# Altium schematic sheet MarsCarrier.SchDoc: My title
size A3; Organization: University of California; Address1: 475 Portola Plaza; Address2: Los Angeles, CA 90095; Revision: R01; SheetNumber: 1; SheetTotal: 1
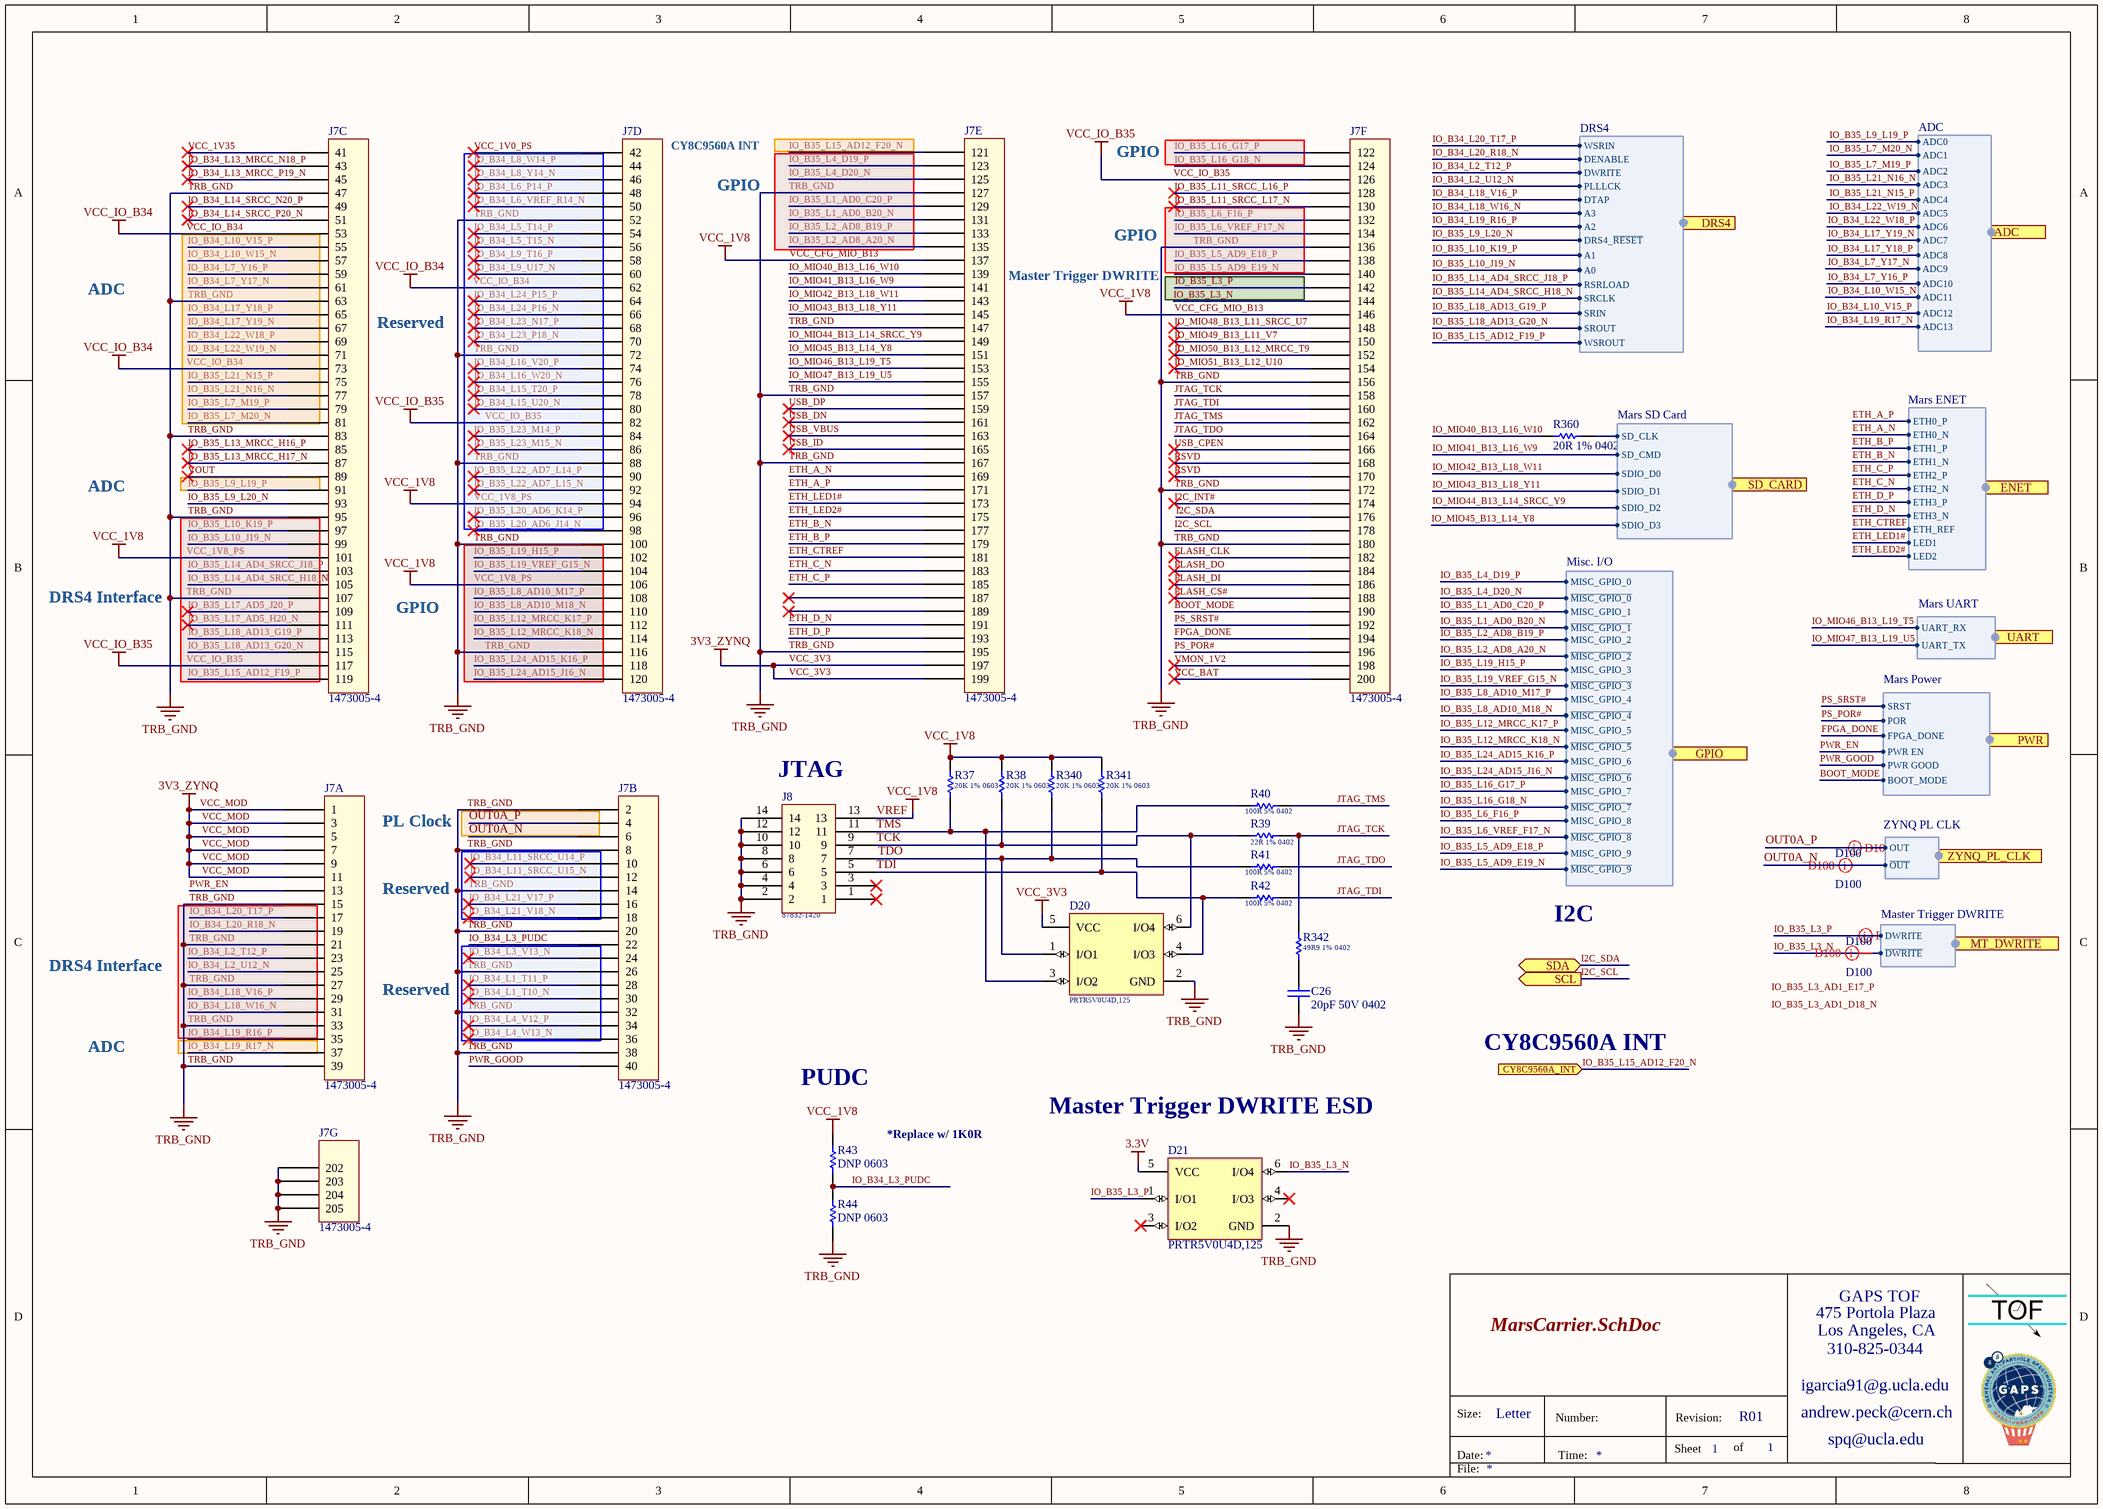
[diagram p0: MarsCarrier.SchDoc]

## Parts
C26  Capacitance: 20pF 50V 0402  [Cap_Murata_GJM1555C1H200GB01D_20pF]  (hidden comment: Cap_Murata_GJM1555C1H200GB01D_20pF)
D20  PRTR5V0U4D,125  [PRTR5V0U4D,125]
D21  PRTR5V0U4D,125  [PRTR5V0U4D,125]
J7  Series: 1473005-4  [DIMM_TE_Connectivity_1473005-4_200POS]  (hidden comment: DIMM_TE_Connectivity_1473005-4_200POS)  (parts A,B,C,D,E,F,G of 7)
J8  Series: 87832-1420  [Header_Molex_87832-1420_14POS]  (hidden comment: Header_Molex_87832-1420_14POS)
R37  20K 1% 0603  [RESC0603(1608)_L]
R38  20K 1% 0603  [RESC0603(1608)_L]
R39  22R 1% 0402  [RESC0402(1005)_L]
R40  100R 5% 0402  [RESC0402(1005)_L]
R41  100R 5% 0402  [RESC0402(1005)_L]
R42  100R 5% 0402  [RESC0402(1005)_L]
R43  Resistance: DNP 0603  [RES_DNP_0603]  (hidden comment: RES_DNP_0603)
R44  Resistance: DNP 0603  [RES_DNP_0603]  (hidden comment: RES_DNP_0603)
R340  20K 1% 0603  [RESC0603(1608)_L]
R341  20K 1% 0603  [RESC0603(1608)_L]
R342  49R9 1% 0402  [RESC0402(1005)_L]
R360  Resistance: 20R 1% 0402  [Res_ROHM_SFR01MZPF20R0_20_Ohm]  (hidden comment: Res_ROHM_SFR01MZPF20R0_20_Ohm)

## Ports
ADC (harness ADC), CY8C9560A_INT (in), DRS4 (harness DRS4), ENET (harness Mars ENET), GPIO (harness Misc. I/O), MT_DWRITE (harness Master Trigger DWRITE), PWR (harness Mars Power), SCL (out), SD_CARD (harness Mars SD Card), SDA (bidir), UART (harness Mars UART), ZYNQ_PL_CLK (harness ZYNQ PL CLK)

## Harnesses
Mars SD Card: SDIO_D2, SDIO_D1, SDIO_D0, SD_CMD, SD_CLK, SDIO_D3
Mars UART: UART_RX, UART_TX
ADC: ADC0, ADC1, ADC2, ADC3, ADC4, ADC5, ADC6, ADC7, ADC8, ADC9, ADC10, ADC11, ADC12, ADC13
Mars ENET: ETH0_P, ETH0_N, ETH1_P, ETH1_N, ETH2_P, ETH2_N, ETH3_P, ETH3_N, ETH_REF, LED1, LED2
Mars Power: PWR GOOD, PWR EN, FPGA_DONE, SRST, POR, BOOT_MODE
ZYNQ PL CLK: OUT, ~{OUT}
Misc. I/O: MISC_GPIO_0, ~{MISC_GPIO_0}, MISC_GPIO_1, ~{MISC_GPIO_1}, MISC_GPIO_2, ~{MISC_GPIO_2}, MISC_GPIO_3, ~{MISC_GPIO_3}, MISC_GPIO_4, ~{MISC_GPIO_4}, MISC_GPIO_5, ~{MISC_GPIO_5}, MISC_GPIO_6, ~{MISC_GPIO_6}, MISC_GPIO_7, ~{MISC_GPIO_7}, MISC_GPIO_8, ~{MISC_GPIO_8}, MISC_GPIO_9, ~{MISC_GPIO_9}
Master Trigger DWRITE: DWRITE, ~{DWRITE}
DRS4: A3, A2, A1, A0, DTAP, SROUT, SRCLK, SRIN, RSRLOAD, WSROUT, DWRITE, PLLLCK, WSRIN, DENABLE, DRS4_~{RESET}

## Nets
3.3V: D21.5(VCC)
TRB_GND: C26.1 D20.2(GND) D21.2(GND) J7.2 J7.8 J7.14 J7.15 J7.20 J7.21 J7.26 J7.27 J7.32 J7.33 J7.38 J7.39 J7.47 J7.52 J7.63 J7.72 J7.83 J7.88 J7.95 J7.100 J7.107 J7.116 J7.127 J7.136 J7.147 J7.156 J7.157 J7.167 J7.172 J7.180 J7.195 J7.202 J7.203 J7.204 J7.205 J8.2 J8.4 J8.6 J8.8 J8.10 J8.12 J8.14 R44.2
VCC_1V8_PS: J7.94 J7.101 J7.106 J7.137 J7.146 J8.13 R37.2 R38.2 R43.1 R340.2 R341.2  [also labelled VCC_1V8, VCC_CFG_MIO_B13, VREF]
VCC_3V3: D20.5(VCC) J7.1 J7.3 J7.5 J7.7 J7.9 J7.11 J7.197 J7.199  [also labelled 3V3_ZYNQ, VCC_MOD]
VCC_IO_B34: J7.53 J7.62 J7.73
VCC_IO_B35: J7.82 J7.117 J7.126
BOOT_MODE: J7.190 ; port PWR.BOOT_MODE
ETH_A_N: J7.169 ; port ENET.ETH0_N
ETH_A_P: J7.171 ; port ENET.ETH0_P
ETH_B_N: J7.177 ; port ENET.ETH1_N
ETH_B_P: J7.179 ; port ENET.ETH1_P
ETH_C_N: J7.183 ; port ENET.ETH2_N
ETH_C_P: J7.185 ; port ENET.ETH2_P
ETH_CTREF: J7.181 ; port ENET.ETH_REF
ETH_D_N: J7.191 ; port ENET.ETH3_N
ETH_D_P: J7.193 ; port ENET.ETH3_P
ETH_LED1#: J7.173 ; port ENET.LED1
ETH_LED2#: J7.175 ; port ENET.LED2
FLASH_CLK: J7.182
FLASH_CS#: J7.188
FLASH_DI: J7.186
FLASH_DO: J7.184
FPGA_DONE: J7.194 ; port PWR.FPGA_DONE
I2C_INT#: J7.174
I2C_SCL: J7.178 ; port SCL
I2C_SDA: J7.176 ; port SDA
IO_B34_L1_T10_N: J7.30
IO_B34_L1_T11_P: J7.28
IO_B34_L2_T12_P: J7.23 ; port DRS4.DWRITE
IO_B34_L2_U12_N: J7.25 ; port DRS4.PLLLCK
IO_B34_L3_PUDC: J7.22 R43.2 R44.1
IO_B34_L3_V13_N: J7.24
IO_B34_L4_V12_P: J7.34
IO_B34_L4_W13_N: J7.36
IO_B34_L5_T14_P: J7.54
IO_B34_L5_T15_N: J7.56
IO_B34_L6_P14_P: J7.48
IO_B34_L6_VREF_R14_N: J7.50
IO_B34_L7_Y16_P: J7.59 ; port ADC.ADC10
IO_B34_L7_Y17_N: J7.61 ; port ADC.ADC9
IO_B34_L8_W14_P: J7.44
IO_B34_L8_Y14_N: J7.46
IO_B34_L9_T16_P: J7.58
IO_B34_L9_U17_N: J7.60
IO_B34_L10_V15_P: J7.55 ; port ADC.ADC12
IO_B34_L10_W15_N: J7.57 ; port ADC.ADC11
IO_B34_L11_SRCC_U14_P: J7.10
IO_B34_L11_SRCC_U15_N: J7.12
IO_B34_L13_MRCC_N18_P: J7.43
IO_B34_L13_MRCC_P19_N: J7.45
IO_B34_L14_SRCC_N20_P: J7.49
IO_B34_L14_SRCC_P20_N: J7.51
IO_B34_L15_T20_P: J7.78
IO_B34_L15_U20_N: J7.80
IO_B34_L16_V20_P: J7.74
IO_B34_L16_W20_N: J7.76
IO_B34_L17_Y18_P: J7.65 ; port ADC.ADC8
IO_B34_L17_Y19_N: J7.67 ; port ADC.ADC7
IO_B34_L18_V16_P: J7.29 ; port DRS4.DTAP
IO_B34_L18_W16_N: J7.31 ; port DRS4.A3
IO_B34_L19_R16_P: J7.35 ; port DRS4.A2
IO_B34_L19_R17_N: J7.37 ; port ADC.ADC13
IO_B34_L20_R18_N: J7.19 ; port DRS4.DENABLE
IO_B34_L20_T17_P: J7.17 ; port DRS4.WSRIN
IO_B34_L21_V17_P: J7.16
IO_B34_L21_V18_N: J7.18
IO_B34_L22_W18_P: J7.69 ; port ADC.ADC6
IO_B34_L22_W19_N: J7.71 ; port ADC.ADC5
IO_B34_L23_N17_P: J7.68
IO_B34_L23_P18_N: J7.70
IO_B34_L24_P15_P: J7.64
IO_B34_L24_P16_N: J7.66
IO_B35_L1_AD0_B20_N: J7.131 ; port GPIO.~{MISC_GPIO_1}
IO_B35_L1_AD0_C20_P: J7.129 ; port GPIO.MISC_GPIO_1
IO_B35_L2_AD8_A20_N: J7.135 ; port GPIO.~{MISC_GPIO_2}
IO_B35_L2_AD8_B19_P: J7.133 ; port GPIO.MISC_GPIO_2
IO_B35_L3_N: D21.6(I/O4) J7.144 ; port MT_DWRITE.~{DWRITE}
IO_B35_L3_P: D21.1(I/O1) J7.142 ; port MT_DWRITE.DWRITE
IO_B35_L4_D19_P: J7.123 ; port GPIO.MISC_GPIO_0
IO_B35_L4_D20_N: J7.125 ; port GPIO.~{MISC_GPIO_0}
IO_B35_L5_AD9_E18_P: J7.138 ; port GPIO.MISC_GPIO_9
IO_B35_L5_AD9_E19_N: J7.140 ; port GPIO.~{MISC_GPIO_9}
IO_B35_L6_F16_P: J7.132 ; port GPIO.MISC_GPIO_8
IO_B35_L6_VREF_F17_N: J7.134 ; port GPIO.~{MISC_GPIO_8}
IO_B35_L7_M19_P: J7.79 ; port ADC.ADC2
IO_B35_L7_M20_N: J7.81 ; port ADC.ADC1
IO_B35_L8_AD10_M17_P: J7.108 ; port GPIO.MISC_GPIO_4
IO_B35_L8_AD10_M18_N: J7.110 ; port GPIO.~{MISC_GPIO_4}
IO_B35_L9_L19_P: J7.91 ; port ADC.ADC0
IO_B35_L9_L20_N: J7.93 ; port DRS4.DRS4_~{RESET}
IO_B35_L10_J19_N: J7.99 ; port DRS4.A0
IO_B35_L10_K19_P: J7.97 ; port DRS4.A1
IO_B35_L11_SRCC_L16_P: J7.128
IO_B35_L11_SRCC_L17_N: J7.130
IO_B35_L12_MRCC_K17_P: J7.112 ; port GPIO.MISC_GPIO_5
IO_B35_L12_MRCC_K18_N: J7.114 ; port GPIO.~{MISC_GPIO_5}
IO_B35_L13_MRCC_H16_P: J7.85
IO_B35_L13_MRCC_H17_N: J7.87
IO_B35_L14_AD4_SRCC_H18_N: J7.105 ; port DRS4.SRCLK
IO_B35_L14_AD4_SRCC_J18_P: J7.103 ; port DRS4.RSRLOAD
IO_B35_L15_AD12_F19_P: J7.119 ; port DRS4.WSROUT
IO_B35_L15_AD12_F20_N: J7.121 ; port CY8C9560A_INT
IO_B35_L16_G17_P: J7.122 ; port GPIO.MISC_GPIO_7
IO_B35_L16_G18_N: J7.124 ; port GPIO.~{MISC_GPIO_7}
IO_B35_L17_AD5_H20_N: J7.111
IO_B35_L17_AD5_J20_P: J7.109
IO_B35_L18_AD13_G19_P: J7.113 ; port DRS4.SRIN
IO_B35_L18_AD13_G20_N: J7.115 ; port DRS4.SROUT
IO_B35_L19_H15_P: J7.102 ; port GPIO.MISC_GPIO_3
IO_B35_L19_VREF_G15_N: J7.104 ; port GPIO.~{MISC_GPIO_3}
IO_B35_L20_AD6_J14_N: J7.98
IO_B35_L20_AD6_K14_P: J7.96
IO_B35_L21_N15_P: J7.75 ; port ADC.ADC4
IO_B35_L21_N16_N: J7.77 ; port ADC.ADC3
IO_B35_L22_AD7_L14_P: J7.90
IO_B35_L22_AD7_L15_N: J7.92
IO_B35_L23_M14_P: J7.84
IO_B35_L23_M15_N: J7.86
IO_B35_L24_AD15_J16_N: J7.120 ; port GPIO.~{MISC_GPIO_6}
IO_B35_L24_AD15_K16_P: J7.118 ; port GPIO.MISC_GPIO_6
IO_MIO40_B13_L16_W10: J7.139 R360.1
IO_MIO41_B13_L16_W9: J7.141 ; port SD_CARD.SD_CMD
IO_MIO42_B13_L18_W11: J7.143 ; port SD_CARD.SDIO_D0
IO_MIO43_B13_L18_Y11: J7.145 ; port SD_CARD.SDIO_D1
IO_MIO44_B13_L14_SRCC_Y9: J7.149 ; port SD_CARD.SDIO_D2
IO_MIO45_B13_L14_Y8: J7.151 ; port SD_CARD.SDIO_D3
IO_MIO46_B13_L19_T5: J7.153 ; port UART.UART_RX
IO_MIO47_B13_L19_U5: J7.155 ; port UART.UART_TX
IO_MIO48_B13_L11_SRCC_U7: J7.148
IO_MIO49_B13_L11_V7: J7.150
IO_MIO50_B13_L12_MRCC_T9: J7.152
IO_MIO51_B13_L12_U10: J7.154
JTAG_TCK: J7.158 R39.1 R342.1
JTAG_TDI: J7.160 R42.1
JTAG_TDO: J7.164 R41.1
JTAG_TMS: J7.162 R40.1
OUT0A_N: J7.6 ; port ZYNQ_PL_CLK.~{OUT}
OUT0A_P: J7.4 ; port ZYNQ_PL_CLK.OUT
PS_POR#: J7.196 ; port PWR.POR
PS_SRST#: J7.192 ; port PWR.SRST
PWR_EN: J7.13 ; port PWR.PWR EN
PWR_GOOD: J7.40 ; port PWR.PWR GOOD
RSVD: J7.168 J7.170
TCK: D20.6(I/O4) J8.9 R38.1 R39.2
TDI: D20.4(I/O3) J8.5 R42.2 R341.1
TDO: D20.1(I/O1) J8.7 R41.2 R340.1
TMS: D20.3(I/O2) J8.11 R37.1 R40.2
USB_CPEN: J7.166
USB_DN: J7.161
USB_DP: J7.159
USB_ID: J7.165
USB_VBUS: J7.163
VCC_1V0_PS: J7.42
VCC_1V35: J7.41
VCC_BAT: J7.200
VMON_1V2: J7.198
VOUT: J7.89
NetC26_2: C26.2 R342.2
NetR360_2: R360.2 ; port SD_CARD.SD_CLK

Not connected (* = marked no-connect by the designer): D21 3(I/O2)* 4(I/O3)*; J7 187* 189*; J8 1* 3*

## Layout directives
differential pair; differential pair class D100: IO_B35_L3_N, IO_B35_L3_P, OUT0A_N, OUT0A_P

## Notes on the sheet
- (near J7) CY8C9560A INT
- GPIO
- ADC
- (near J7) Master Trigger DWRITE
- (near J7) Reserved
- DRS4 Interface
- (near J8) JTAG
- PL Clock
- Reserved
- I2C
- CY8C9560A INT
- PUDC
- (near D21) Master Trigger DWRITE ESD
- *Replace w/ 1K0R
- Labels drawn without touching a wire or pin: IO_B35_L3_AD1_D18_N, IO_B35_L3_AD1_E17_P
- 475 Portola Plaza
- GAPS TOF
- igarcia91@g.ucla.edu
- Los Angeles, CA
- 310-825-0344
- Size:
- Date:
- Letter
- Number:
- Time:
- Sheet
- Revision:
- of
- andrew.peck@cern.ch
- spq@ucla.edu
- File:

## Library data of the parts
C26 = Cap_Murata_GJM1555C1H200GB01D_20pF: Multilayer Ceramic Capacitors MLCC - SMD/SMT 0402 20pF 50Volts C0G 2%; Supplier 1: Mouser; Supplier Part Number 1: 81-GJM1555C1H200GB01
D20 D21 = PRTR5V0U4D,125: ESD Suppressors / TVS Diodes 5.5V QUAD R-R ESD ULTRA LOW CAP; Supplier 1: Mouser; Supplier Part Number 1: 771-PRTR5V0U4D-T/R
J7 = DIMM_TE_Connectivity_1473005-4_200POS: DIMM Connectors DDR2 SODIMM 200P STANDARD HOUSING; Supplier 1: Mouser; Supplier Part Number 1: 571-1473005-4
J8 = Header_Molex_87832-1420_14POS: Headers & Wire Housings 14P SMD PB FREE SHRD; Supplier Part Number 1: 538-87832-1420; Supplier 1: Mouser
R37 R38 R340 R341 = CMP-1012-00655-1: 20K 0.1W 1% 0603 (1608 Metric)  SMD; Case-Metric: 1608; Case-EIA: 0603; Value: 20000.00 Ohm; Technology: SMT; Tolerance: 1 %; Power: 0.1 W
R39 = CMP-1011-00320-1: 22R 0.063W 1% 0402 (1005 Metric)  SMD; Case-EIA: 0402; Case-Metric: 1005; Value: 22.00 Ohm; Tolerance: 1 %; Technology: SMT; Power: 0.063 W
R40-R42 = CMP-1011-00050-1: 100R 0.063W 5% 0402 (1005 Metric)  SMD; Case-EIA: 0402; Value: 100.00 Ohm; Case-Metric: 1005; Tolerance: 5 %; Technology: SMT; Power: 0.063 W
R43 R44 = RES_DNP_0603: 0603 Do not place resistor
R342 = CMP-1011-00363-1: 49R9 0.063W 1% 0402 (1005 Metric)  SMD; Case-EIA: 0402; Case-Metric: 1005; Value: 49.90 Ohm; Power: 0.063 W; Technology: SMT; Tolerance: 1 %
R360 = Res_ROHM_SFR01MZPF20R0_20_Ohm: 20R 62.5mW 1% 0402 (1005 Metric)  SMD; Supplier 1: Mouser; Supplier Part Number 1: 755-SFR01MZPF20R0